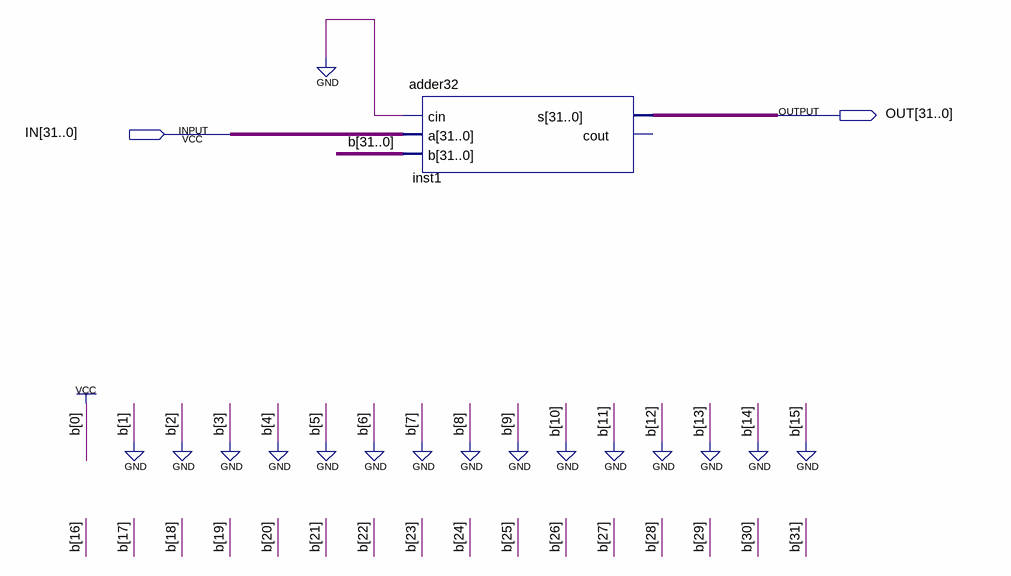
[diagram p0: schematic sheet]
// Quartus schematic incrementer32.bdf as structural Verilog: 1 symbols, 2 pins
module incrementer32 (
  input  [31:0] IN,
  output [31:0] OUT
);

  wire [31:16] b;

  adder32 inst1 (.cin(1'b0), .a(IN), .b({b, 16'b0000000000000001}), .s(OUT));  // open: cout
endmodule
